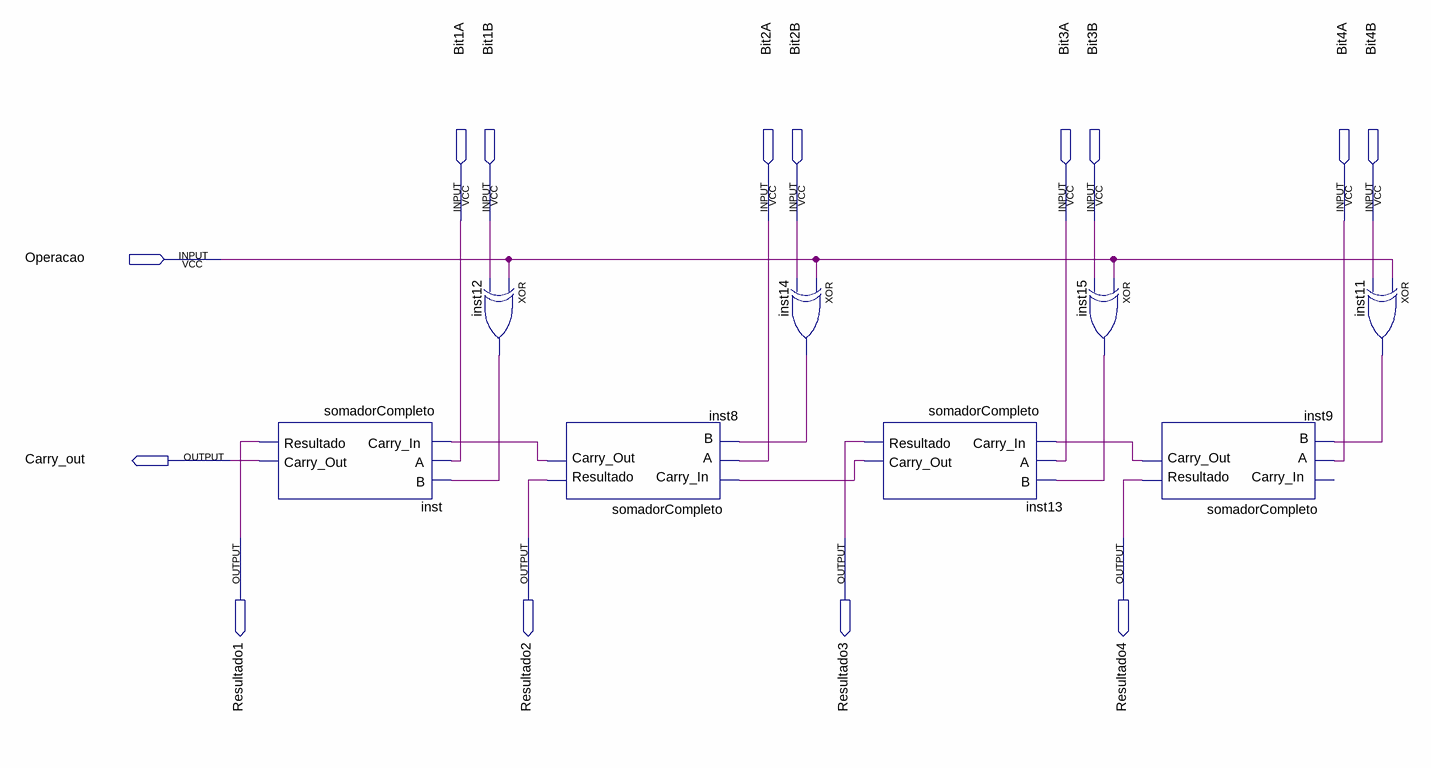
[diagram p0: schematic sheet]
// Quartus schematic unidadeSoma.bdf as structural Verilog: 8 symbols, 14 pins
module unidadeSoma (
  input  Bit1A,
  input  Bit1B,
  input  Bit2A,
  input  Bit2B,
  input  Bit3A,
  input  Bit3B,
  input  Bit4A,
  input  Bit4B,
  input  Operacao,
  output Carry_out,
  output Resultado1,
  output Resultado2,
  output Resultado3,
  output Resultado4
);

  wire inst8_carry_out, inst9_carry_out, inst11_out, inst12_out, inst13_carry_out, inst14_out, inst15_out;

  somadorCompleto inst (
    .Carry_In(inst8_carry_out), .A(Bit1A), .B(inst12_out), .Resultado(Resultado1), .Carry_Out(Carry_out));
  xor inst12 (inst12_out, Operacao, Bit1B);
  somadorCompleto inst8 (
    .Carry_In(inst13_carry_out), .A(Bit2A), .B(inst14_out), .Resultado(Resultado2),
    .Carry_Out(inst8_carry_out));
  xor inst14 (inst14_out, Operacao, Bit2B);
  somadorCompleto inst13 (
    .Carry_In(inst9_carry_out), .A(Bit3A), .B(inst15_out), .Resultado(Resultado3),
    .Carry_Out(inst13_carry_out));
  xor inst15 (inst15_out, Operacao, Bit3B);
  somadorCompleto inst9 (
    .A(Bit4A), .B(inst11_out), .Resultado(Resultado4), .Carry_Out(inst9_carry_out));  // open: Carry_In
  xor inst11 (inst11_out, Operacao, Bit4B);
endmodule
